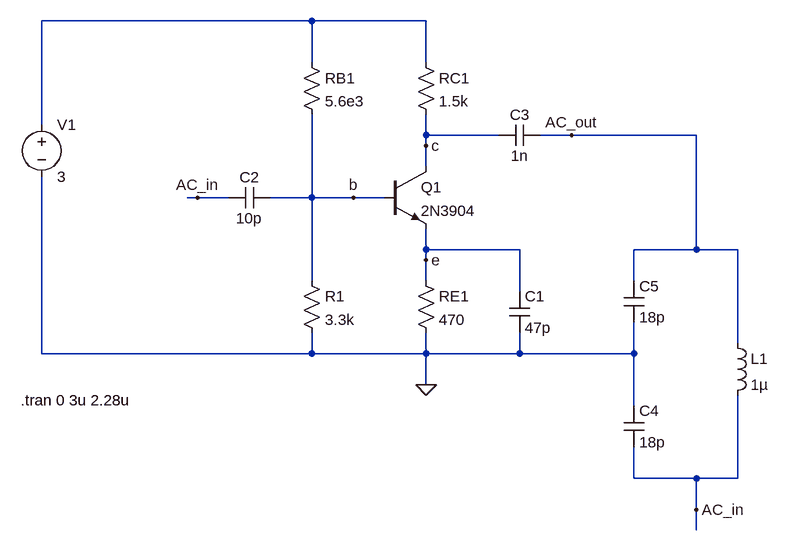
[diagram p0: schematic 02-Common_self-biasing.asc]
02-Common_self-biasing.asc, the LTspice schematic file:
Version 4
SHEET 1 916 680
WIRE 176 -176 -240 -176
WIRE 352 -176 176 -176
WIRE 176 -112 176 -176
WIRE 352 -112 352 -176
WIRE -240 -16 -240 -176
WIRE 352 0 352 -32
WIRE 464 0 352 0
WIRE 576 0 528 0
WIRE 768 0 576 0
WIRE 352 16 352 0
WIRE 352 48 352 16
WIRE 0 96 -16 96
WIRE 48 96 0 96
WIRE 176 96 176 -32
WIRE 176 96 112 96
WIRE 240 96 176 96
WIRE 288 96 240 96
WIRE 352 176 352 144
WIRE 496 176 352 176
WIRE 768 176 768 0
WIRE 768 176 672 176
WIRE 832 176 768 176
WIRE 352 192 352 176
WIRE 176 224 176 96
WIRE 352 224 352 192
WIRE 672 224 672 176
WIRE 496 240 496 176
WIRE 832 320 832 176
WIRE -240 336 -240 64
WIRE 176 336 176 304
WIRE 176 336 -240 336
WIRE 352 336 352 304
WIRE 352 336 176 336
WIRE 496 336 496 304
WIRE 496 336 352 336
WIRE 672 336 672 288
WIRE 672 336 496 336
WIRE 352 384 352 336
WIRE 672 416 672 336
WIRE 672 528 672 480
WIRE 768 528 672 528
WIRE 832 528 832 400
WIRE 832 528 768 528
WIRE 768 576 768 528
WIRE 768 608 768 576
FLAG 352 192 e
FLAG 352 16 c
FLAG 352 384 0
FLAG 240 96 b
FLAG 0 96 AC_in
FLAG 576 0 AC_out
FLAG 768 576 AC_in
SYMBOL voltage -240 -32 R0
WINDOW 123 0 0 Left 0
WINDOW 39 0 0 Left 0
SYMATTR InstName V1
SYMATTR Value 3
SYMBOL res 336 -128 R0
SYMATTR InstName RC1
SYMATTR Value 1.5k
SYMBOL npn 288 48 R0
SYMATTR InstName Q1
SYMATTR Value 2N3904
SYMBOL res 336 208 R0
SYMATTR InstName RE1
SYMATTR Value 470
SYMBOL res 160 -128 R0
SYMATTR InstName RB1
SYMATTR Value 5.6e3
SYMBOL res 160 208 R0
SYMATTR InstName R1
SYMATTR Value 3.3k
SYMBOL cap 480 240 R0
SYMATTR InstName C1
SYMATTR Value 47p
SYMBOL cap 112 80 R90
WINDOW 0 0 32 VBottom 2
WINDOW 3 32 32 VTop 2
SYMATTR InstName C2
SYMATTR Value 10p
SYMBOL cap 528 -16 R90
WINDOW 0 0 32 VBottom 2
WINDOW 3 32 32 VTop 2
SYMATTR InstName C3
SYMATTR Value 1n
SYMBOL cap 656 224 R0
SYMATTR InstName C5
SYMATTR Value 18p
SYMBOL ind 816 304 R0
SYMATTR InstName L1
SYMATTR Value 1µ
SYMBOL cap 656 416 R0
SYMATTR InstName C4
SYMATTR Value 18p
TEXT -272 408 Left 2 !.tran 0 3u 2.28u

The netlist it stands for:
* 02-Common_self-biasing.asc
V1 N001 0 3
RC1 N001 c 1.5k
Q1 c b e 0 2N3904
RE1 e 0 470
RB1 N001 b 5.6e3
R1 b 0 3.3k
C1 e 0 47p
C2 b AC_in 10p
C3 AC_out c 1n
C5 AC_out 0 18p
L1 AC_out AC_in 1µ
C4 0 AC_in 18p
.model NPN NPN
.model PNP PNP
.lib standard.bjt
.tran 0 3u 2.28u
.backanno
.end